# Altium schematic sheet Power.SchDoc
size A4; SheetNumber: 2; SheetTotal: 7
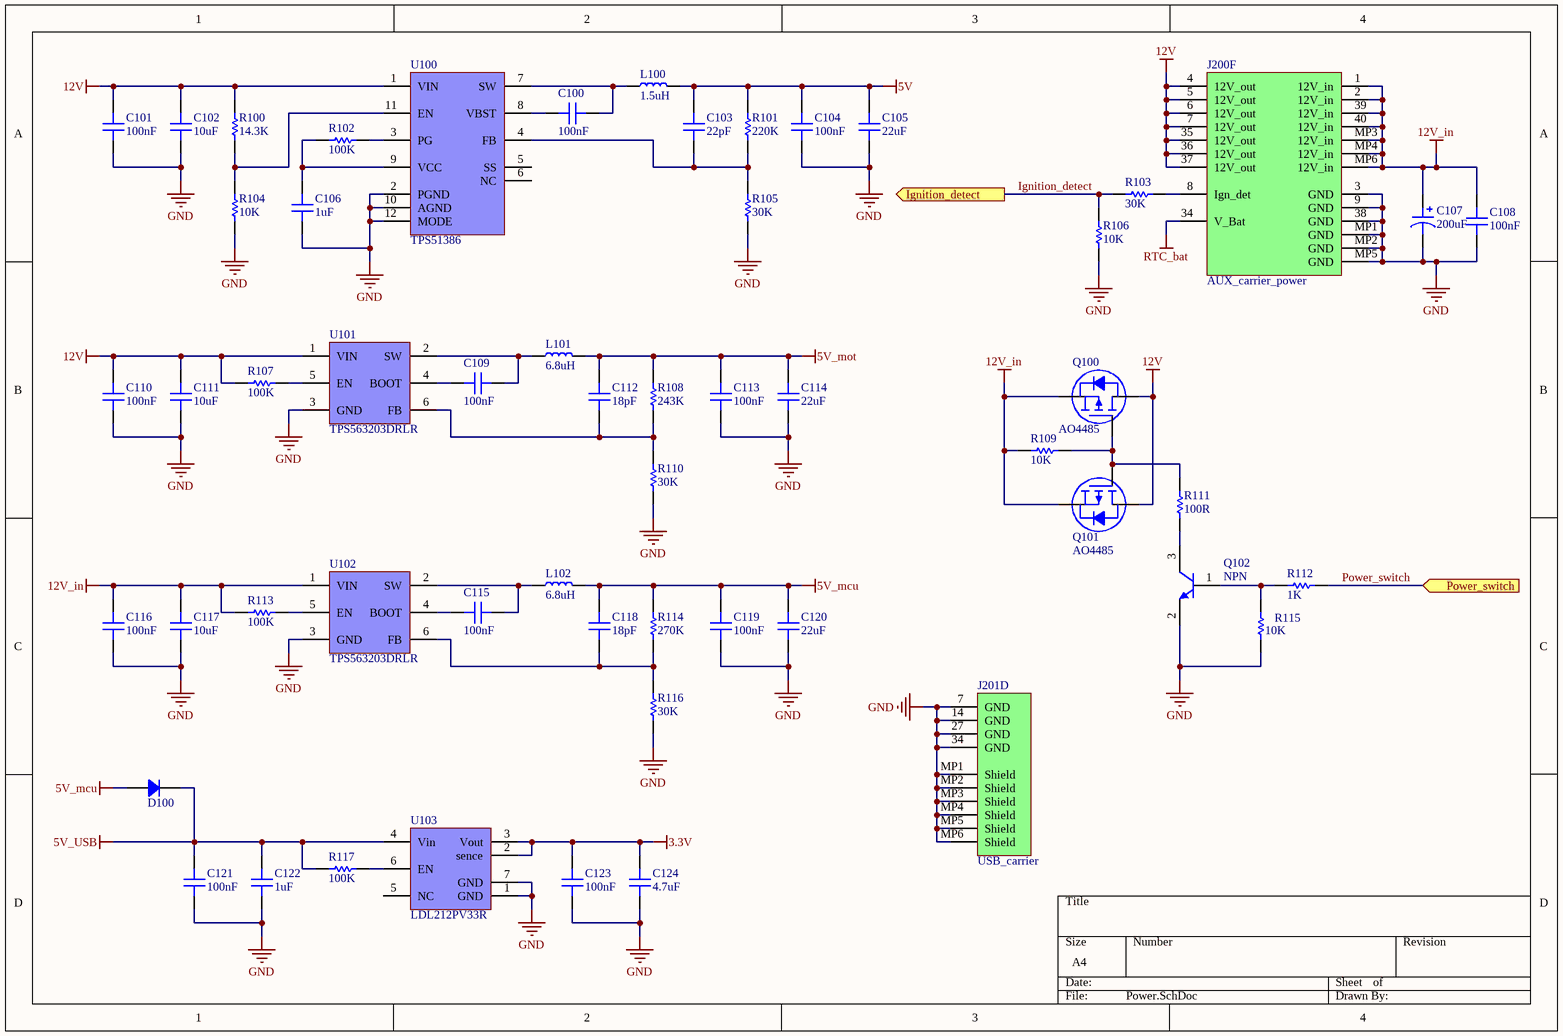
[diagram p0: Power.SchDoc]

## Parts
C100  100nF  [CAP 0603]
C101  100nF  [CAP 0603]
C102  10uF  [CAP 1206]
C103  22pF  [CAP 0603]
C104  100nF  [CAP 0603]
C105  22uF  [CAP 1206]
C106  1uF  [CAP 0603]
C107  200uF  [CAP ALSMD ELEC 6.6MM H5.7MM]
C108  100nF  [CAP 0603]
C109  100nF  [CAP 0603]
C110  100nF  [CAP 0603]
C111  10uF  [CAP 1206]
C112  18pF  [CAP 0603]
C113  100nF  [CAP 0603]
C114  22uF  [CAP 1206]
C115  100nF  [CAP 0603]
C116  100nF  [CAP 0603]
C117  10uF  [CAP 1206]
C118  18pF  [CAP 0603]
C119  100nF  [CAP 0603]
C120  22uF  [CAP 1206]
C121  100nF  [CAP 0603]
C122  1uF  [CAP 0603]
C123  100nF  [CAP 0603]
C124  4.7uF  [CAP 1206]
D100  (no value)  [Bourns DO214AC SMA - duplicate]
J200  AUX_carrier_power  [2167010409]  (part F of 6)
J201  USB_carrier  [2167010409]  (part D of 4)
L100  1.5uH  [IND 0806_2016]
L101  6.8uH  [IND 0806_2016]
L102  6.8uH  [IND 0806_2016]
Q100  AO4485  [ALPHAOMEGA SO8 SOP-8L AO4485]
Q101  AO4485  [ALPHAOMEGA SO8 SOP-8L AO4485]
Q102  NPN  [SOT-23]
R100  14.3K  [RES 0603]
R101  220K  [RES 0603]
R102  100K  [RES 0603]
R103  30K  [RES 0603]
R104  10K  [RES 0603]
R105  30K  [RES 0603]
R106  10K  [RES 0603]
R107  100K  [RES 0603]
R108  243K  [RES 0603]
R109  10K  [RES 0603]
R110  30K  [RES 0603]
R111  100R  [RES 0603]
R112  1K  [RES 0603]
R113  100K  [RES 0603]
R114  270K  [RES 0603]
R115  10K  [RES 0603]
R116  30K  [RES 0603]
R117  100K  [RES 0603]
U100  TPS51386  [VREG_TPS51386RJNR]
U101  TPS563203DRLR  [TI SOT-563 DRL]
U102  TPS563203DRLR  [TI SOT-563 DRL]
U103  LDL212PV33R  [SON50P200X200X80-7N-D]

## Ports
Ignition_detect (out, see Main_scheme[3A], Sub_MCU[2B]), Power_switch (in, see Main_scheme[3A], Sub_MCU[2B])

## Nets
3.3V: C123.2 C124.2 U103.2(sence) U103.3(Vout)
5V: C103.2 C104.2 C105.2 L100.2 R101.2
5V_mcu: C118.2 C119.2 C120.2 D100.1 L102.2 R114.2
5V_mot: C112.2 C113.2 C114.2 L101.2 R108.2
5V_USB: C121.2 C122.2 D100.2 R117.1 U103.4(Vin)
12V: C101.2 C102.2 C110.2 C111.2 J200.4(12V_out) J200.5(12V_out) J200.6(12V_out) J200.7(12V_out) J200.35(12V_out) J200.36(12V_out) J200.37(12V_out) Q100.D Q101.D R100.1 R107.1 U100.1(VIN) U101.1(VIN)
12V_in: C107.2 C108.2 C116.2 C117.2 J200.1(12V_in) J200.2(12V_in) J200.39(12V_in) J200.40(12V_in) J200.MP3(12V_in) J200.MP4(12V_in) J200.MP6(12V_in) Q100.S Q101.S R109.2 R113.1 U102.1(VIN)
GND: C101.1 C102.1 C104.1 C105.1 C106.1 C107.1 C108.1 C110.1 C111.1 C113.1 C114.1 C116.1 C117.1 C119.1 C120.1 C121.1 C122.1 C123.1 C124.1 J200.3(GND) J200.9(GND) J200.38(GND) J200.MP1(GND) J200.MP2(GND) J200.MP5(GND) J201.7(GND) J201.14(GND) J201.27(GND) J201.34(GND) J201.MP1(Shield) J201.MP2(Shield) J201.MP3(Shield) J201.MP4(Shield) J201.MP5(Shield) J201.MP6(Shield) Q102.2(E) R104.1 R105.1 R106.2 R110.1 R115.2 R116.1 U100.2(PGND) U100.10(AGND) U100.12(MODE) U101.3(GND) U102.3(GND) U103.1(GND) U103.7(GND)
RTC_bat: J200.34(V_Bat)
Ignition_detect: R103.2 R106.1 ; port Ignition_detect
Power_switch: R112.1 ; port Power_switch
NetC100_1: C100.1 L100.1 U100.7(SW)
NetC100_2: C100.2 U100.8(VBST)
NetC103_1: C103.1 R101.1 R105.2 U100.4(FB)
NetC106_2: C106.2 R102.1 U100.9(VCC)
NetC109_1: C109.1 L101.1 U101.2(SW)
NetC109_2: C109.2 U101.4(BOOT)
NetC112_1: C112.1 R108.1 R110.2 U101.6(FB)
NetC115_1: C115.1 L102.1 U102.2(SW)
NetC115_2: C115.2 U102.4(BOOT)
NetC118_1: C118.1 R114.1 R116.2 U102.6(FB)
NetJ200_8: J200.8(Ign_det) R103.1
NetQ100_G: Q100.G Q101.G R109.1 R111.1
NetQ102_1: Q102.1(B) R112.2 R115.1
NetQ102_3: Q102.3(C) R111.2
NetR100_2: R100.2 R104.2 U100.11(EN)
NetR102_2: R102.2 U100.3(PG)
NetR107_2: R107.2 U101.5(EN)
NetR113_2: R113.2 U102.5(EN)
NetR117_2: R117.2 U103.6(EN)

Not connected (* = marked no-connect by the designer): U100 5(SS) 6(NC); U103 5(NC)

## Library data of the parts
C100-C106 C108-C124 = Capacitor: SMT Capacitor
  C100 C101 C104 C108-C110 C113 C115 C116 C119 C121 C123: Value: 100nF
  C102 C111 C117: Value: 10uF
  C103: Value: 22pF
  C105 C114 C120: Value: 22uF
  C106 C122: Value: 1uF
  C112 C118: Value: 18pF
  C124: Value: 4.7uF
C107 = Capacitor polarized: SMT Polarised Capacitor; Value: 200uF
D100 = Diode: Rectifier Diode
J200 = AUX_carrier
L100-L102 = Inductor: SMT Inductor
  L100: Value: 1.5uH
  L101 L102: Value: 6.8uH
Q100 Q101 = AO4485: MOSFET P-CH 40V 10A 8SOIC; Manufacturer: Alpha & Omega Semiconductor Inc.; Current - Continuous Drain (Id) @ 25°C: 10A (Ta); Drive Voltage (Max Rds On,  Min Rds On): 4.5V, 10V; FET Type: P-Channel; Gate Charge (Qg) (Max) @ Vgs: 55 nC @ 10 V; Input Capacitance (Ciss) (Max) @ Vds: 3000 pF @ 20 V; Power Dissipation (Max): 1.7W (Ta); Rds On (Max) @ Id, Vgs: 15mOhm @ 10A, 10V; Vgs (Max): ±20V; Vgs(th) (Max) @ Id: 2.5V @ 250µA; Part Number: AO4485; ComponentLink1Description: Datasheet; ComponentLink1URL: http://aosmd.com/res/data_sheets/AO4485.pdf; ComponentLink2Description: DigiKey Link; ComponentLink2URL: https://www.digikey.com/en/products/detail/alpha-omega-semiconductor-inc/AO4485/3152385; Drain to Source Voltage (Vdss): 40 V; LastUpdated: 25.09.2022 4:45:44; Lifecycle Status: Active; Minimum Order: 1; Mounting Type: Surface Mount; Operating Temperature: -55°C ~ 150°C (TJ); Package / Case: 8-SOIC (0.154", 3.90mm Width); Packaging: TapeAndReel; Part Status: Active; Price: 0.35; Series: -; Supplier 1: DigiKey; Supplier Part Number 1: 785-1551-1-ND; Supplier Device Package: 8-SOIC; Technology: MOSFET (Metal Oxide)
R100-R117 = Res: Resistor; Ordered by: Subcon; Published: 8-Jun-2000; Revision: July-2002: Re-released for DXP Platform.; Publisher: Altium Limited
  R100: Value: 14.3K
  R101: Value: 220K
  R102 R107 R113 R117: Value: 100K
  R103 R105 R110 R116: Value: 30K
  R104 R106 R109 R115: Value: 10K
  R108: Value: 243K
  R111: Value: 100R
  R112: Value: 1K
  R114: Value: 270K